# Altium schematic sheet Deathsound_power_amp_channel.SchDoc
size A4
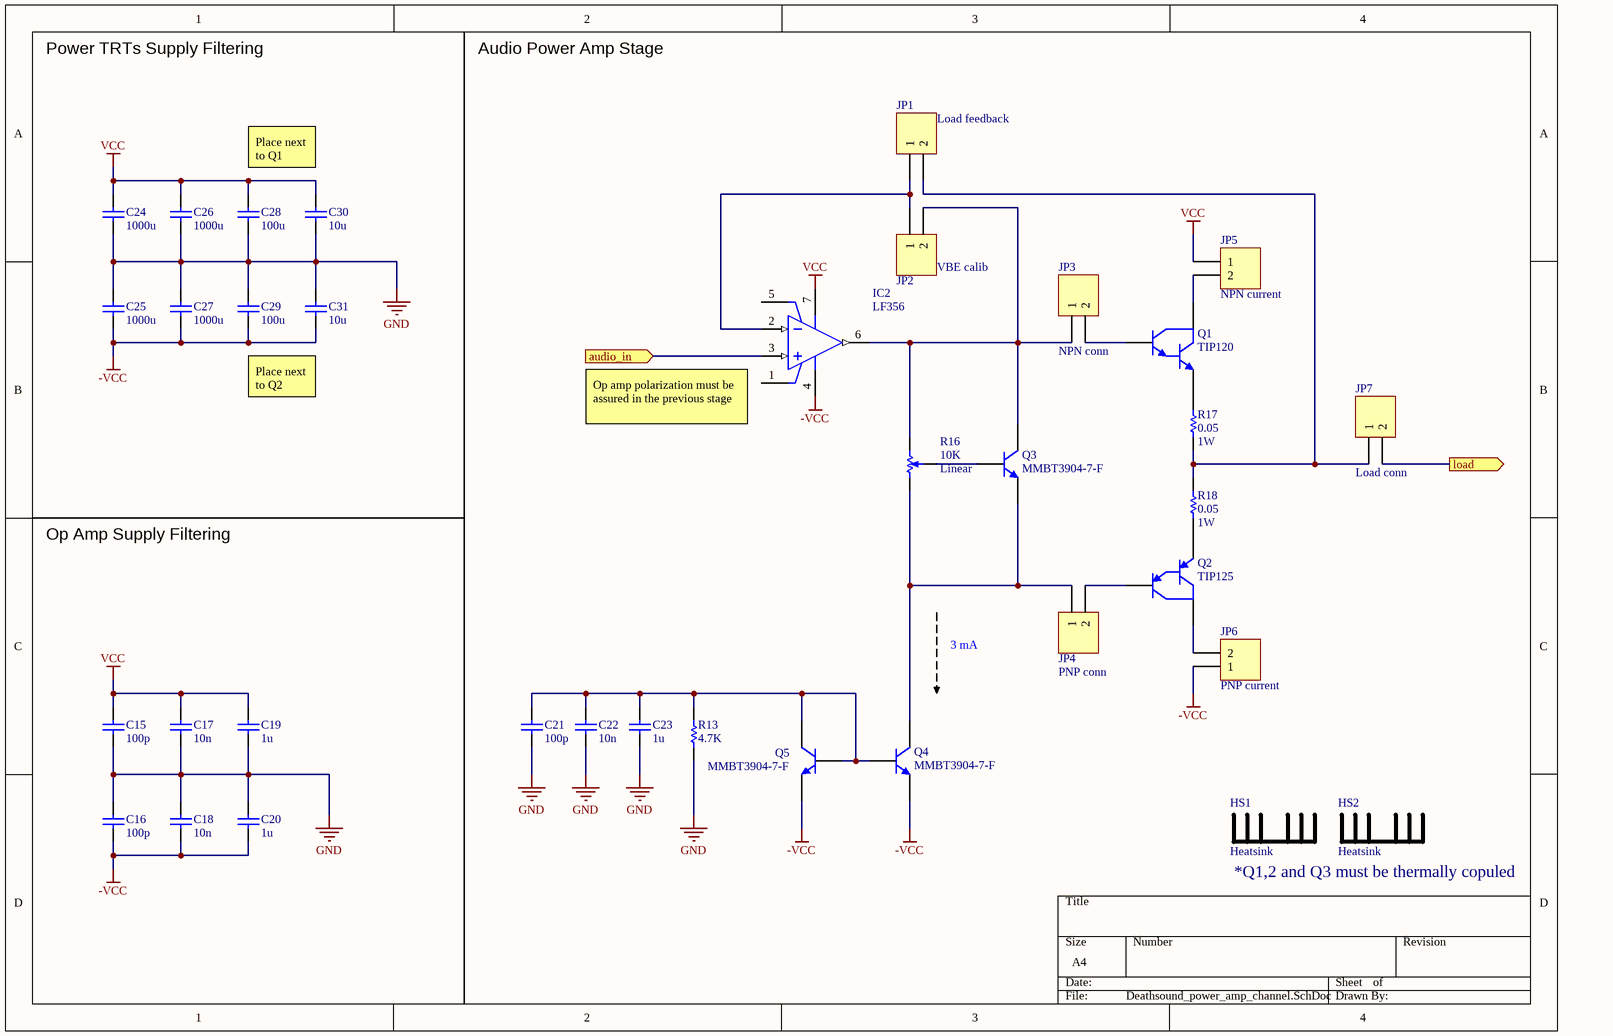
[diagram p0: Deathsound_power_amp_channel.SchDoc]

## Parts
C15  100p  [C0805]
C16  100p  [C0805]
C17  10n  [C0805]
C18  10n  [C0805]
C19  1u  [C0805]
C20  1u  [C0805]
C21  100p  [C0805]
C22  10n  [C0805]
C23  1u  [C0805]
C24  1000u  [C0805]
C25  1000u  [C0805]
C26  1000u  [C0805]
C27  1000u  [C0805]
C28  100u  [C0805]
C29  100u  [C0805]
C30  10u  [C0805]
C31  10u  [C0805]
HS1  Heatsink  [MC33289]
HS2  Heatsink  [MC33289]
IC2  LF356  [SOIC127P600X175-8N]
JP1  Load feedback  [HDR1X2]
JP2  VBE calib  [HDR1X2]
JP3  NPN conn  [HDR1X2]
JP4  PNP conn  [HDR1X2]
JP5  NPN current  [HDR1X2]
JP6  PNP current  [HDR1X2]
JP7  Load conn  [HDR1X2]
Q1  TIP120  [TO-220]
Q2  TIP125  [TO-220]
Q3  MMBT3904-7-F  [SOT95P240X110-3N]
Q4  MMBT3904-7-F  [SOT95P240X110-3N]
Q5  MMBT3904-7-F  [SOT95P240X110-3N]
R13  4.7K  [R0805]
R16  10K  Type: Linear  [Res Pot Square Trimm]
R17  0.05  Power: 1W  [R2512]
R18  0.05  Power: 1W  [R2512]

## Ports
audio_in (in), load (out)

## Nets
-VCC: C16.1 C18.1 C20.1 C25.1 C27.1 C29.1 C31.1 IC2.4(V-) JP6.1 Q4.2(E) Q5.2(E)
GND: C15.1 C16.2 C17.1 C18.2 C19.1 C20.2 C21.1 C22.1 C23.1 C24.1 C25.2 C26.1 C27.2 C28.1 C29.2 C30.1 C31.2 R13.2
VCC: C15.2 C17.2 C19.2 C24.2 C26.2 C28.2 C30.2 IC2.7(V+) JP5.1
audio_in: IC2.3(IN+) ; port audio_in
load: JP7.2 ; port load
NetC21_2: C21.2 C22.2 C23.2 Q4.1(B) Q5.1(B) Q5.3(C) R13.1
NetIC2_2: IC2.2(IN-) JP1.1 JP2.1
NetIC2_6: IC2.6(OUT) JP2.2 JP3.1 Q3.3(C) R16.1
NetJP1_2: JP1.2 JP7.1 R17.1 R18.2
NetJP3_2: JP3.2 Q1.1(B)
NetJP4_1: JP4.1 Q3.2(E) Q4.3(C) R16.3
NetJP4_2: JP4.2 Q2.1(B)
NetJP5_2: JP5.2 Q1.2(C)
NetJP6_2: JP6.2 Q2.2(C)
NetQ1_3: Q1.3(E) R17.2
NetQ2_3: Q2.3(E) R18.1
NetQ3_1: Q3.1(B) R16.2

Not connected (* = marked no-connect by the designer): IC2 1(BALANCE1) 5(BALANCE2)

## Notes on the sheet
- Power TRTs Supply Filtering
- Audio Power Amp Stage
- Place next
  to Q1
- Place next
  to Q2
- (near IC2) Op amp polarization must be
  assured in the previous stage
- Op Amp Supply Filtering
- 3 mA
- *Q1,2 and Q3 must be thermally copuled

## Library data of the parts
C15-C31 = Capacitor
  C15 C16 C21: Value: 100p
  C17 C18 C22: Value: 10n
  C19 C20 C23: Value: 1u
  C24-C27: Value: 1000u
  C28 C29: Value: 100u
  C30 C31: Value: 10u
HS1 = Heatsink (MC33289): Q1 Heatsink
HS2 = Heatsink (MC33289): Q2 Heatsink
JP1-JP7 = Header 2: Header, 2-Pin
Q1 = TIP120/121/122: NPN Darlington Bipolar Transistor
Q2 = TIP125/126/127: PNP Darlington Bipolar Transistor
Q3-Q5 = MMBT3904-7-F: NPN General Purpose Amplifier SMD
R13 R17 R18 = Resistor
  R13: Value: 4.7K
  R17 R18: Value: 0.05
R16 = Res Pot: Square Trimming Potentiometer; Value: 10K